# EAGLE board kulgurpowerMCU2 (EAGLE 6.3)
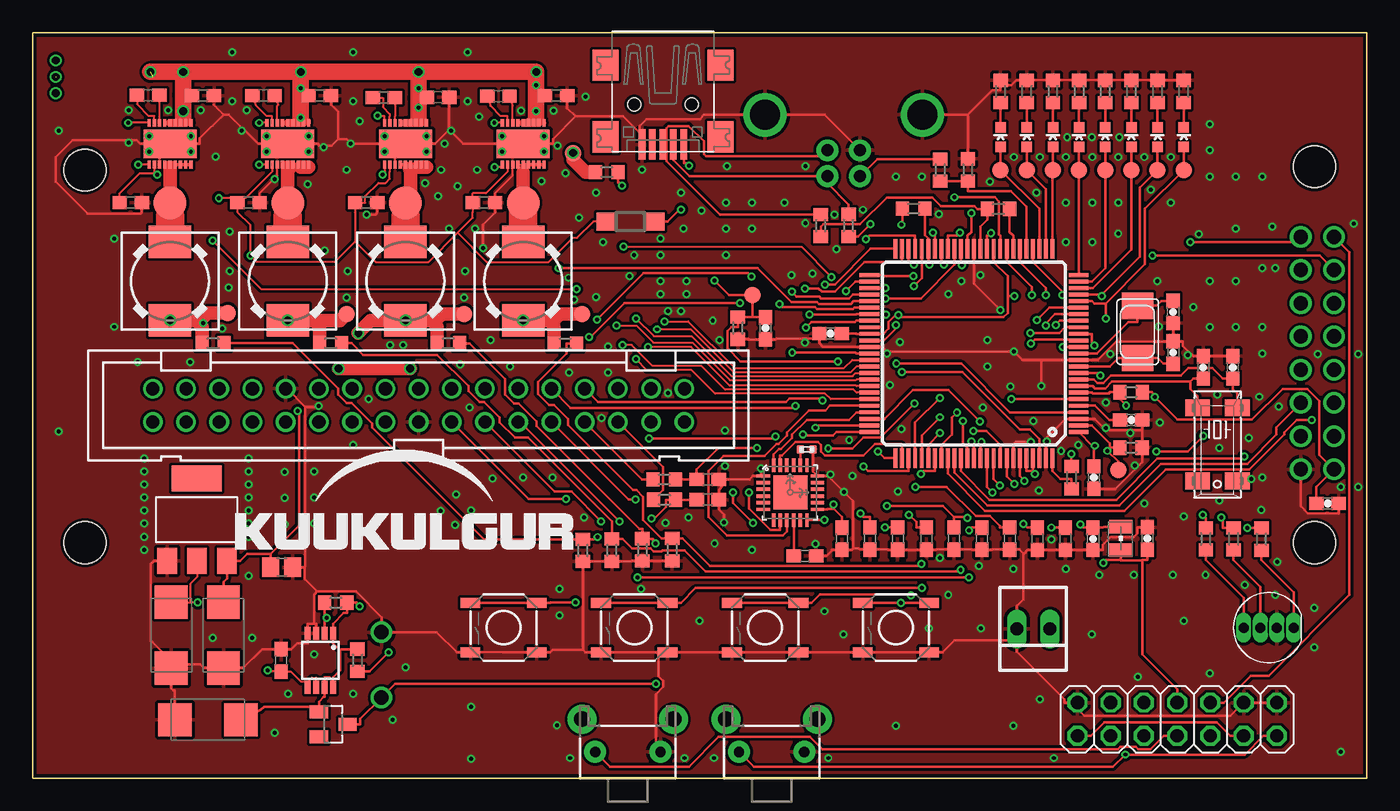
[diagram p6: board, top side]
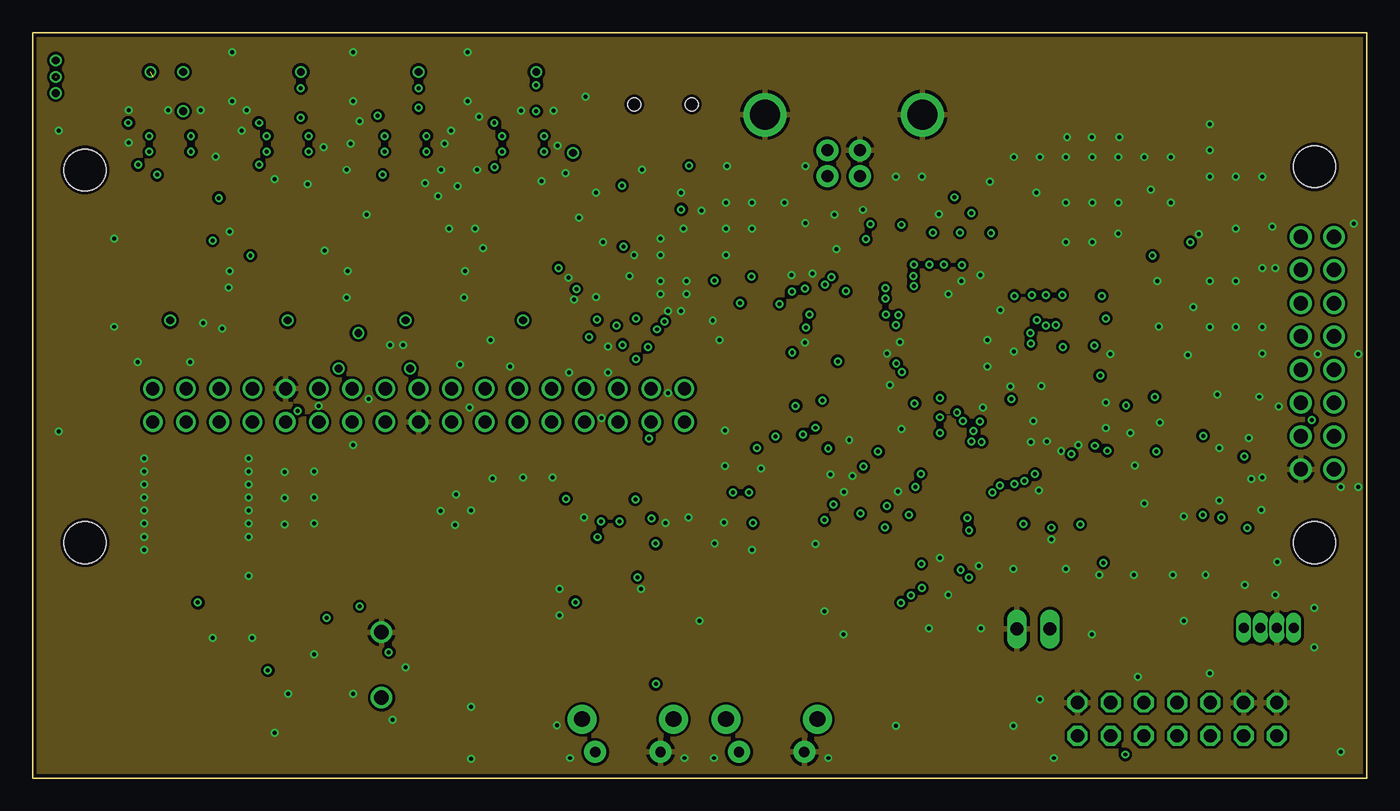
[diagram p7: board, inner layer Route2]
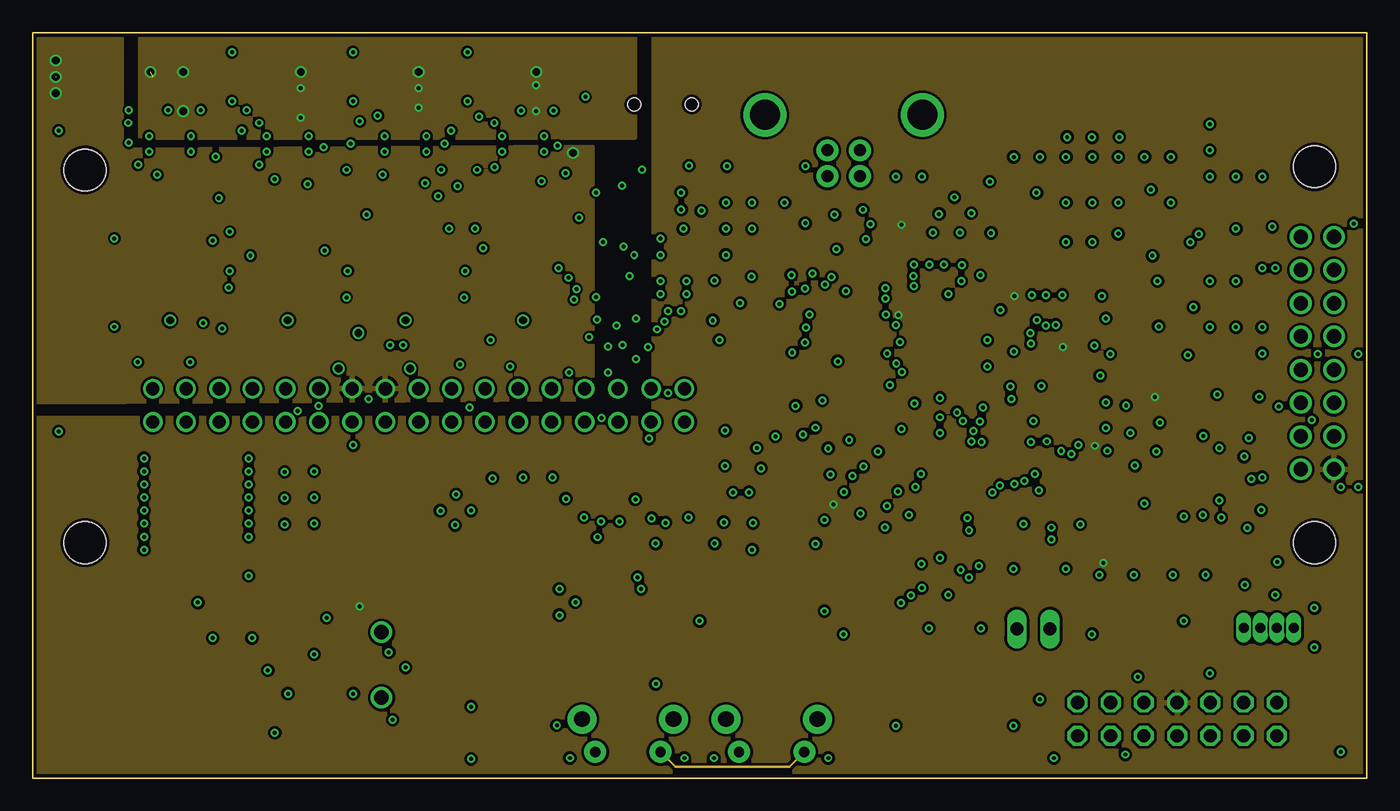
[diagram p8: board, inner layer Route15]
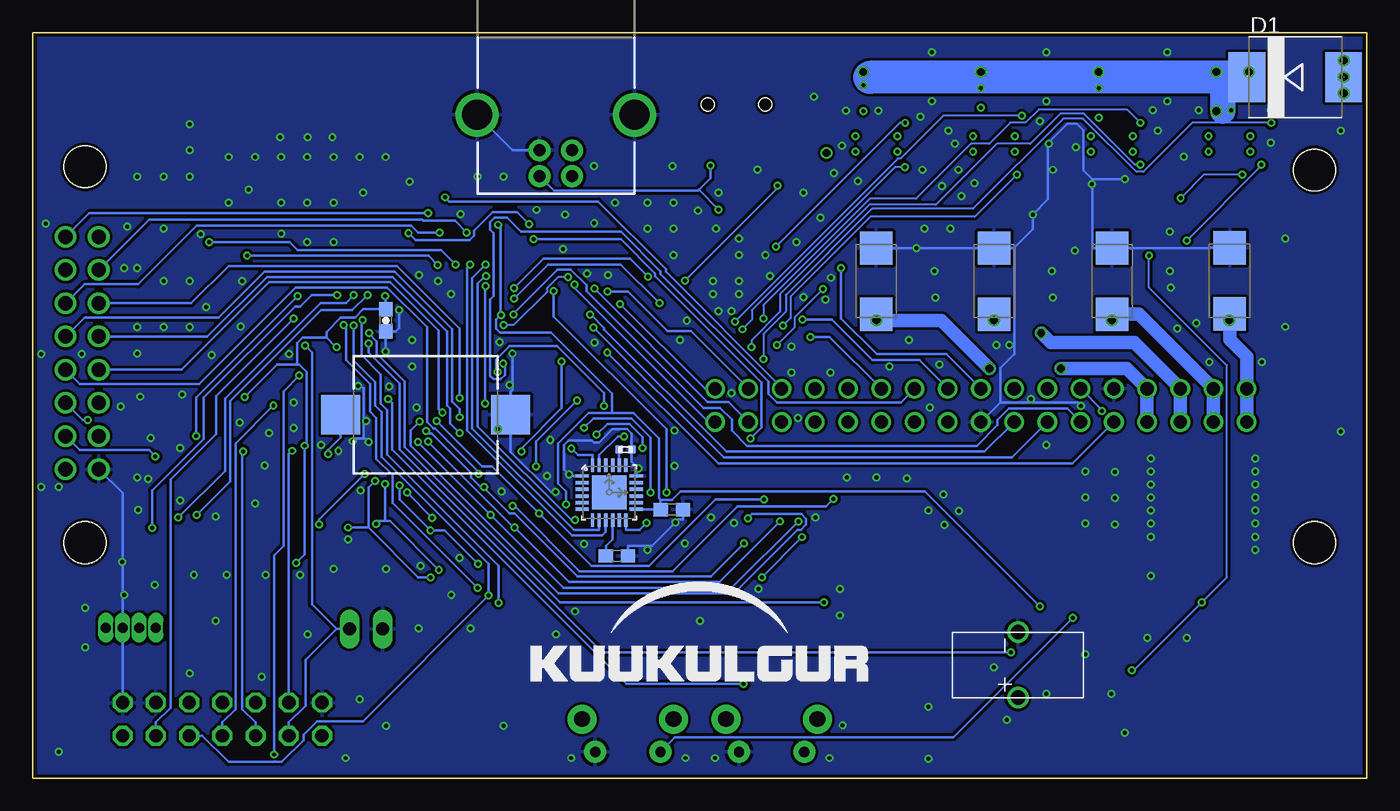
[diagram p9: board, bottom side, seen from below]

Size 102 x 57 mm. Coordinates in mm from the lower left corner, seen from the top.
Outline: 0,0 0,57 102,57 102,0 0,0
Copper layers (1*2*15*16): Top 0.035mm / dielectric 0.2mm / Route2 0.0175mm / dielectric 1.1mm / Route15 0.0175mm / dielectric 0.2mm / Bottom 0.035mm
Design rules "SeeedStudio_DRU_no_angle_20130527": minimum track width 6mil, minimum drill 12mil, track to track 6mil, track to pad 6mil, pad to pad 6mil, via to via 6mil, smd to smd 0mil, copper to edge 10mil, drill to drill 10mil, minimum pad ring 6mil, minimum via ring 6mil, stop-mask expansion 2mil, vias tented up to drill 25mil, thermal gap 10mil
Net classes: 0 default: width 0.203 mm, drill 0.3 mm, clearance 0.203 mm; 1 power: width 0.635 mm, drill 0.6 mm, clearance 0.178 mm; 2 morepower: width 1.016 mm, drill 0.6 mm, clearance 0.178 mm; 3 thin: width 0.152 mm, drill 0.3 mm, clearance 0.152 mm

## Footprints (pad centres in the part's own frame; a part is rotated, then mirrored left to right if it is on the bottom)
B1,27 = smd 1.27 x 1.27: TP 0,0
C0603 = smd 1.1 x 1: 1 -0.85,0; 2 0.85,0
0603-CAP = smd 1.1 x 1: 1 -0.85,0; 2 0.85,0
C/6032-28R = smd 2.55 x 2.5: + 2.525,0; - -2.525,0
C0402 = smd 0.59 x 0.64: 1 -0.48,0; 2 0.48,0
C0805 = smd 1.3 x 1.5: 1 -0.85,0; 2 0.85,0
USB-MINIB = smd 0.5 x 2.308: D+ 0,4.064; D- -0.8,4.064; GND 1.6,4.064; ID 0.8,4.064; VBUS -1.6,4.064 | smd 2 x 2.4: GND1 -4.4,-2; GND2 -4.4,3.5; GND3 4.4,3.5; GND4 4.4,-2 | hole 1: -2.2,1; 2.2,1
SMC = smd 2.8 x 3.8: A 3.7,0; C -3.7,0
SOD123 = smd 1.4 x 1.4: A 1.9,0; C -1.9,0
SOT23 = smd 1 x 1.4: 1 -0.95,-1.1; 2 0.95,-1.1; 3 0,1.1
LED-RGB-THRU = drill 0.762 pad 0.889 long: 1 1.905,0; 2 0.635,0; 3 -0.635,0; 4 -1.905,0
MSOP8 = smd 0.45 x 1: 1 -0.975,-2.05; 2 -0.325,-2.05; 3 0.325,-2.05; 4 0.975,-2.05; 5 0.975,2.05; 6 0.325,2.05; 7 -0.325,2.05; 8 -0.975,2.05
SOT223 = smd 1.499 x 2.007: 1 -2.261,-3.15; 2 0.025,-3.15; 3 2.311,-3.15 | smd 3.81 x 2.007: 4 0,3.15
2X07 = drill 1.016 octagon: 1 -7.62,-1.27; 2 -7.62,1.27; 3 -5.08,-1.27; 4 -5.08,1.27; 5 -2.54,-1.27; 6 -2.54,1.27; 7 0,-1.27; 8 0,1.27; 9 2.54,-1.27; 10 2.54,1.27; 11 5.08,-1.27; 12 5.08,1.27; 13 7.62,-1.27; 14 7.62,1.27
WE-KI_0805_B = smd 1.02 x 1.78: 1 -0.89,0; 2 0.89,0
DR73 = smd 2.5 x 3.25: 1 -3,0; 2 3,0
LED-0603 = smd 0.8 x 0.8: A 0,-0.75; C 0,0.75
MM20SS = smd 1.27 x 1.88: 1 -2.794,-1.524; 2 2.794,-1.524; 3 2.794,1.524; 4 -2.794,1.524
R0603 = smd 1 x 1.1: 1 -0.85,0; 2 0.85,0
TACTILE-PTH-SIDEEZ = drill 0.8 pad 1.7: 1 -2.5,0; 2 2.5,0 | drill 1.2 pad 2.2: ANCHOR1 -3.5,2.5; ANCHOR2 3.5,2.5
TACTILE_SWITCH_SMD = smd 1.524 x 0.762: 1 -2.54,1.905; 2 2.54,1.905; 3 -2.54,-1.905; 4 2.54,-1.905
BUZZER-CMT1102 = smd 3 x 3: 1 -6.5,0; 2 6.5,0
B2,54 = smd 2.54 x 2.54: TP 0,0
QFN-24-TESTING = smd 1.016 x 0.254: 1 -2.066,1.257; 2 -2.066,0.75; 3 -2.066,0.247; 4 -2.066,-0.287; 5 -2.066,-0.792; 6 -2.066,-1.297; 13 2.086,-1.297; 14 2.086,-0.792; 15 2.086,-0.287; 16 2.086,0.247; 17 2.086,0.75; 18 2.086,1.257 | smd 0.254 x 1.016: 7 -1.267,-2.122; 8 -0.762,-2.122; 9 -0.258,-2.122; 10 0.278,-2.122; 11 0.78,-2.122; 12 1.287,-2.122; 19 1.287,2.082; 20 0.78,2.082; 21 0.278,2.082; 22 -0.258,2.082; 23 -0.762,2.082; 24 -1.267,2.082 | smd 2.616 x 2.616: P$1 0.02,-0.01
EDLRD224V3R6C = drill 1.1: N 2.5,0; P -2.5,0
USB-B-PTH = drill 0.914 pad 1.676: D+ 0,1.25; D- 1.981,1.25; GND 0,-1.25; VBUS 1.981,-1.25 | drill 2.286: S1 -2.718,-6.02; S2 -2.718,6.02
ER-OLEDM032-1 = drill 1.1: P$1 96.2,8.11; P$2 98.74,8.11; P$3 96.2,10.65; P$4 98.74,10.65; P$5 96.2,13.19; P$6 98.74,13.19; P$7 96.2,15.73; P$8 98.74,15.73; P$9 96.2,18.27; P$10 98.74,18.27; P$11 96.2,20.81; P$12 98.74,20.81; P$13 96.2,23.35; P$14 98.74,23.35; P$15 96.2,25.89; P$16 98.74,25.89 | hole 3.2: 3.25,31; 3.25,2.5; 97.25,2.5; 97.25,31.25
LTQFP100 = smd 1.5 x 0.3: 1 -8,6; 2 -8,5.5; 3 -8,5; 4 -8,4.5; 5 -8,4; 6 -8,3.5; 7 -8,3; 8 -8,2.5; 9 -8,2; 10 -8,1.5; 11 -8,1; 12 -8,0.5; 13 -8,0; 14 -8,-0.5; 15 -8,-1; 16 -8,-1.5; 17 -8,-2; 18 -8,-2.5; 19 -8,-3; 20 -8,-3.5; 21 -8,-4; 22 -8,-4.5; 23 -8,-5; 24 -8,-5.5; 25 -8,-6; 51 8,-6; 52 8,-5.5; 53 8,-5; 54 8,-4.5; 55 8,-4; 56 8,-3.5; 57 8,-3; 58 8,-2.5; 59 8,-2; 60 8,-1.5; 61 8,-1; 62 8,-0.5; 63 8,0; 64 8,0.5; 65 8,1; 66 8,1.5; 67 8,2; 68 8,2.5; 69 8,3; 70 8,3.5; 71 8,4; 72 8,4.5; 73 8,5; 74 8,5.5; 75 8,6 | smd 0.3 x 1.5: 26 -6,-8; 27 -5.5,-8; 28 -5,-8; 29 -4.5,-8; 30 -4,-8; 31 -3.5,-8; 32 -3,-8; 33 -2.5,-8; 34 -2,-8; 35 -1.5,-8; 36 -1,-8; 37 -0.5,-8; 38 0,-8; 39 0.5,-8; 40 1,-8; 41 1.5,-8; 42 2,-8; 43 2.5,-8; 44 3,-8; 45 3.5,-8; 46 4,-8; 47 4.5,-8; 48 5,-8; 49 5.5,-8; 50 6,-8; 76 6,8; 77 5.5,8; 78 5,8; 79 4.5,8; 80 4,8; 81 3.5,8; 82 3,8; 83 2.5,8; 84 2,8; 85 1.5,8; 86 1,8; 87 0.5,8; 88 0,8; 89 -0.5,8; 90 -1,8; 91 -1.5,8; 92 -2,8; 93 -2.5,8; 94 -3,8; 95 -3.5,8; 96 -4,8; 97 -4.5,8; 98 -5,8; 99 -5.5,8; 100 -6,8
CSD97374Q4M = smd 0.25 x 0.6: P$1 -1.6,-1.6; P$2 -1.2,-1.6; P$3 -0.8,-1.6; P$4A -0.4,-1.6; P$4B 0,-1.6; P$4C 0.4,-1.6; P$4D 0.8,-1.6; P$4E 1.2,-1.6; P$4F 1.6,-1.6; P$5A -0.4,1.6; P$5B 0,1.6; P$5C 0.4,1.6; P$5D 0.8,1.6; P$5E 1.2,1.6; P$5F 1.6,1.6; P$6 -0.8,1.6; P$7 -1.2,1.6; P$8 -1.6,1.6 | smd 4.05 x 2.2: PAD@1 0,0 | drill 0.3: PAD@9 -1.6,0.6; PAD@10 -1.6,-0.6; PAD@11 1.6,0.6; PAD@12 1.6,-0.6
NX5032 = smd 2 x 2.4: P$1 2,0; P$2 -2,0
PAK100/2500-34 = drill 1 pad 1.422: 1 -20.32,-1.27; 2 -20.32,1.27; 3 -17.78,-1.27; 4 -17.78,1.27; 5 -15.24,-1.27; 6 -15.24,1.27; 7 -12.7,-1.27; 8 -12.7,1.27; 9 -10.16,-1.27; 10 -10.16,1.27; 11 -7.62,-1.27; 12 -7.62,1.27; 13 -5.08,-1.27; 14 -5.08,1.27; 15 -2.54,-1.27; 16 -2.54,1.27; 17 0,-1.27; 18 0,1.27; 19 2.54,-1.27; 20 2.54,1.27; 21 5.08,-1.27; 22 5.08,1.27; 23 7.62,-1.27; 24 7.62,1.27; 25 10.16,-1.27; 26 10.16,1.27; 27 12.7,-1.27; 28 12.7,1.27; 29 15.24,-1.27; 30 15.24,1.27; 31 17.78,-1.27; 32 17.78,1.27; 33 20.32,-1.27; 34 20.32,1.27
22-23-2021 = drill 1 long: 1 -1.27,0; 2 1.27,0

## Placement (x,y rotation side)
19V  TPB1,27  [B1,27]  41.32,47.8 90 top
AN0  TPB1,27  [B1,27]  55.05,36.92 90 top
C1  0.1  [C0603]  72.57,18.31 270 top
C2  0.1  [C0603]  74.69,18.32 270 top
C3  0.1  [C0603]  66.13,18.31 270 top
C4  0.1  [0603-CAP]  83.98,27.39 180 top
C5  0.1  [C0603]  64.01,18.32 270 top
C6  18pf  [0603-CAP]  87.19,32.54 270 top
C7  18pf  [0603-CAP]  87.19,35.64 90 top
C8  0.1  [C0603]  76.82,18.3 270 top
C9  [0603-CAP]  89.49,31.41 270 top
C10  0.1  [C0603]  68.32,18.31 270 top
C11  [0603-CAP]  91.76,31.41 270 top
C12  0.1  [0603-CAP]  56.03,34.4 270 top
C13  0,1  [0603-CAP]  81.07,18.3 270 top
C14  0,1  [0603-CAP]  85.23,18.33 90 top
C15  0.1  [C0603]  78.94,18.3 270 top
C16  [C/6032-28R]  10.59,10.93 90 top
C17  0.1  [C0603]  70.44,18.32 270 top
C18  [C/6032-28R]  13.39,4.45 0 top
C19  100n  [C0603]  59.05,16.97 0 top
C20  2.2nF / 50V  [C0402]  59.18,25.12 0 top
C21  100n  [C0603]  61.88,18.3 270 top
C22  0.1  [C0603]  51.61,22.83 0 top
C23  1uF/ 26V  [C0805]  19.03,16.13 0 top
C24  100n  [C0603]  57.33,16.98 0 bottom
C25  2.2nF / 50V  [C0402]  56.68,25.11 0 bottom
C26  100n  [C0603]  53.13,20.52 0 bottom
C27  0.1  [C0603]  8.83,52.21 0 top
C28  1uF/6V  [C0603]  19,9 90 top
C29  0.1  [C0603]  25.5,44 0 top
C30  0.1  [C0603]  31,52.05 0 top
C31  0.1  [C0603]  17.65,52.19 0 top
C32  0.1  [C0603]  7.5,44 0 top
C33  0.1  [C0603]  40.02,52.17 0 top
C34  0.1  [C0603]  26.85,52.02 0 top
C35  0.1  [C0603]  16.5,44 0 top
C36  0.1  [C0603]  21.95,52.18 0 top
C37  0.1  [C0603]  35.61,52.13 0 top
C38  0.1  [C0603]  34.5,44 0 top
C39  0.1  [C0603]  13.01,52.19 0 top
C40  0.1  [C0603]  51.61,21.29 0 top
C41  [C/6032-28R]  14.59,10.94 90 top
C42  [C/6032-28R]  10.49,38.02 270 bottom
C43  [C/6032-28R]  19.48,38 270 bottom
C44  [C/6032-28R]  28.5,38 270 bottom
C45  [C/6032-28R]  37.52,38 270 bottom
C46  0,1  [0603-CAP]  61,34 180 top
C47  0,1  [0603-CAP]  75,35 270 bottom
C48  0,1  [0603-CAP]  81.14,22.98 270 top
C49  0,1  [0603-CAP]  99,21 0 top
CN2  [USB-MINIB]  48.19,52.51 180 top
D1  MBRS320T3  [SMC]  5.47,53.59 0 bottom
D2  MBR0520LT  [SOD123]  45.69,42.56 0 top
D7  BAT54  [SOT23]  22.98,4.12 270 top
D8  WP154A4SUREQBFZGW  [LED-RGB-THRU]  94.5,11.5 0 top
EMLE  TPB1,27  [B1,27]  82.99,23.58 0 top
IC2  TPS77333DGK  [MSOP8]  22,9 180 top
IC3  REG1117-5  [SOT223]  12.54,19.75 0 top
JP2  [2X07]  87.5,4.5 0 top
L1  4,7uH  [WE-KI_0805_B]  83.19,18.32 90 top
L2  4,7uH  [DR73]  10.5,38 270 top
L3  4,7uH  [DR73]  19.5,38 270 top
L4  4,7uH  [DR73]  28.5,38 270 top
L5  4,7uH  [DR73]  37.5,38 270 top
LED0  [LED-0603]  74,49 0 top
LED1  [LED-0603]  76,49 0 top
LED2  [LED-0603]  78,49 0 top
LED3  [LED-0603]  80,49 0 top
LED4  [LED-0603]  82,49 0 top
LED5  [LED-0603]  84,49 0 top
LED6  [LED-0603]  86,49 0 top
LED7  [LED-0603]  88,49 0 top
Q1  [MM20SS]  90.57,25.51 270 top
R1  301k  [R0603]  40.72,33.22 0 top
R2  100k  [R0603]  48.89,17.47 270 top
R3  301k  [R0603]  31.78,33.23 0 top
R4  100k  [R0603]  46.62,17.45 270 top
R5  47k  [R0603]  83.98,29.51 0 top
R6  47k  [R0603]  24.84,9.01 90 top
R7  1k  [R0603]  74,52.5 270 top
R8  1k  [R0603]  76,52.5 270 top
R9  47k  [R0603]  67.36,43.54 0 top
R10  1k5  [R0603]  73.84,43.51 180 top
R11  301k  [R0603]  22.78,33.25 0 top
R12  1k  [R0603]  78,52.5 270 top
R13  100k  [R0603]  44.28,17.42 270 top
R14  1k  [R0603]  80,52.5 270 top
R15  47k  [R0603]  83.97,25.27 0 top
R16  301k  [R0603]  13.8,33.25 0 top
R17  100k  [R0603]  42.06,17.4 270 top
R18  100k  [R0603]  53.92,34.4 270 top
R19  1k  [R0603]  79.43,22.96 270 top
R22  47k  [R0603]  23.17,13.42 180 top
R23  680k  [R0603]  43.89,46.33 180 top
R24  22r  [R0603]  62.37,42.26 90 top
R25  22r  [R0603]  60.25,42.25 90 top
R26  30k  [R0603]  71.5,46.5 90 top
R27  17k  [R0603]  69.38,46.49 270 top
R28  1k  [R0603]  82,52.5 270 top
R29  1k  [R0603]  84,52.5 270 top
R30  1k  [R0603]  86,52.5 270 top
R31  1k  [R0603]  88,52.5 270 top
R32  1k  [R0603]  93.94,18.27 90 top
R33  1k  [R0603]  91.81,18.28 90 top
R34  1k  [R0603]  89.69,18.29 90 top
R35  10k  [R0603]  48.29,22.83 0 top
R36  10k  [R0603]  48.31,21.29 0 top
S1  PROG  [TACTILE-PTH-SIDEEZ]  45.5,2 0 top
S2  SW4  [TACTILE_SWITCH_SMD]  66,11.5 180 top
S6  SW1  [TACTILE_SWITCH_SMD]  36,11.5 180 top
S7  SW2  [TACTILE_SWITCH_SMD]  46,11.5 180 top
S8  SW3  [TACTILE_SWITCH_SMD]  56,11.5 180 top
S9  RESET  [TACTILE-PTH-SIDEEZ]  56.5,2 0 top
SG1  BUZZERSMD3  [BUZZER-CMT1102]  71.97,27.79 0 bottom
TP5  TPB2,54  [B2,54]  19.5,44 180 top
TP8  TPB2,54  [B2,54]  10.5,44 180 top
TP10  TPB2,54  [B2,54]  28.5,44 180 top
TP15  TPB2,54  [B2,54]  37.5,44 180 top
TPLED0  LED0  [B1,27]  74,46.5 90 top
TPLED1  LED0  [B1,27]  76,46.5 90 top
TPLED2  LED0  [B1,27]  78,46.5 90 top
TPLED3  LED0  [B1,27]  80,46.5 90 top
TPLED4  LED0  [B1,27]  82,46.5 90 top
TPLED5  LED0  [B1,27]  84,46.5 90 top
TPLED6  LED0  [B1,27]  86,46.5 90 top
TPLED7  LED0  [B1,27]  88,46.5 90 top
U1  MPU-6000QFN-24  [QFN-24-TESTING]  57.91,21.84 0 top
U2  MPU-6000QFN-24  [QFN-24-TESTING]  57.93,21.84 0 bottom
U$1  EDLRD224V3R6C  [EDLRD224V3R6C]  26.66,8.65 90 bottom
U$2  USB+SHIELD  [USB-B-PTH]  62,48 270 bottom
U$3  ER-OLEDM032-1  [ER-OLEDM032-1]  0.75,15.5 0 top
U$14  R5F5630ADDFP  [LTQFP100]  71.97,32.47 180 top
U$16  CSD97374Q4M  [CSD97374Q4M]  10.5,48.5 0 top
U$17  CSD97374Q4M  [CSD97374Q4M]  19.5,48.5 0 top
U$18  CSD97374Q4M  [CSD97374Q4M]  28.5,48.5 0 top
U$19  CSD97374Q4M  [CSD97374Q4M]  37.5,48.5 0 top
VBAT0  TPB1,27  [B1,27]  14.92,35.57 180 top
VBAT1  TPB1,27  [B1,27]  24,35.5 0 top
VBAT2  TPB1,27  [B1,27]  33,35.5 180 top
VBAT3  TPB1,27  [B1,27]  42,35.5 180 top
X1  12Mhz  [NX5032]  84.47,34.12 270 top
X2  2534-  [PAK100/2500-34]  29.5,28.5 0 top
X3  22-23-2021  [22-23-2021]  76.5,11.4 180 top

## Tracks (layer width: path | path; a pad name or v marks a point on that pad's centre or on a via)
5V  (via drill 0.3 pad 0.61)
  Top 0.152: U$19.P$2 36.3,46.37 34.66,44.73 33.65,44.73 C38.1 33.65,43.27 33.65,42.85 32.49,41.69 | D2.C 42.86,42.56 41.62,41.32 41.3,41.32 39.45,39.47 34.71,39.47 32.49,41.69 | 9.3,46.23 8.16,46.23 6.65,44.73 C32.1 | v9.52,46.13 9.41,46.23 9.3,46.23 | U$16.P$2 9.3,46.23 | 15.65,44.36 v14.24,44.36 | 15.65,44.36 16.29,44.36 18.3,46.37 U$17.P$2 | 24.65,41.04 26.23,39.46 30.26,39.46 32.49,41.69 | 24.65,41.04 23.08,39.47 17.13,39.47 v16.65,39.95 16.65,42.28 15.65,43.27 C35.1 15.65,44.36 | 24.65,41.04 24.65,43.27 C29.1 25.43,44 25.43,44.49 26.44,45.51 26.98,45.51 27.3,45.83 27.3,46.37 U$18.P$2 | v17.98,8.23 18.19,8.23 18.27,8.15 C28.1 19.73,8.15 20.52,7.36 21.02,7.36 | v12.63,13.42 12.11,13.42 12.07,13.45 | IC3.2 12.56,15.37 12.07,14.88 12.07,13.45 | C16.+ 12.07,13.45 | 21.02,7.36 21.34,7.68 21.68,7.68 IC2.6 | 21.02,7.36 21.02,7.31 IC2.5
  Bottom 0.152: v9.52,46.13 12.48,46.13 v14.24,44.36 | v16.65,39.95 16.65,37.52 10.69,31.56 10.69,15.36 v12.63,13.42 17.82,8.23 v17.98,8.23
!OLED_CS  (via drill 0.3 pad 0.61)
  Top 0.203: JP2.10 91.06,5.77 93.12,7.83 94.51,7.83 100.67,13.99 100.67,40.21 U$3.P$16 | U$14.39 71.47,41.47 71.76,41.76 v71.76,43.2
  Bottom 0.203: v71.76,43.2 97.69,43.2 U$3.P$16
!OLED_DC  (via drill 0.3 pad 0.61)
  Top 0.203: v71.05,39.24 71.05,39.39 70.97,39.47 U$14.40 | v71.05,39.24 | U$3.P$14 98.4,39.94 v85.62,39.94
  Bottom 0.203: v85.62,39.94 71.75,39.94 v71.05,39.24
!OLED_RD  (via drill 0.3 pad 0.61)
  Top 0.203: U$14.42 69.97,41.47 70.65,41.47 v70.89,41.71
  Bottom 0.203: v70.89,41.71 72.52,41.71 73.05,42.25 89.46,42.25 93.93,37.77 98.03,37.77 U$3.P$12
!OLED_RESET  (via drill 0.3 pad 0.61)
  Top 0.203: U$14.43 69.47,39.47 | v88.51,40.98 96.54,40.98 U$3.P$15 | 69.47,39.47 | 69.47,39.47 v69.68,39.25
  Bottom 0.203: v88.51,40.98 82.35,40.98 81.73,40.36 70.79,40.36 v69.68,39.25
!OLED_WR  (via drill 0.3 pad 0.61)
  Top 0.203: U$14.44 68.97,41.56 v68.82,41.71
  Bottom 0.203: U$3.P$13 93.1,42.7 72.24,42.7 72.15,42.61 69.72,42.61 v68.82,41.71
!RESET  (via drill 0.3 pad 0.61)
  Top 0.203: S9.1 55.14,0.86 82.59,0.86 v83.53,1.8 92.67,1.8 94.1,3.23 JP2.13 | U$14.10 81.41,30.97 v81.61,30.77 | 22.32,12.25 22.32,12.61 22.32,12.62 R22.2 | IC2.2 22.32,12.25 | v22.48,12.25 22.32,12.25
  Bottom 0.203: v81.61,30.77 82.83,29.56 82.83,17.74 83.53,17.04 v83.53,1.8 | v22.48,12.25 31.6,3.12 52.88,3.12 S9.1
!SKIP0  (via drill 0.3 pad 0.61)
  Top 0.152: v45.1,33.13 45.8,33.13 47.4,31.53 51.12,31.53 52.94,29.71 62.75,29.71 62.99,29.47 U$14.69 | U$16.P$1 v8.05,46.9 | v13.77,41.1 17.48,37.39 v41.57,37.39
  Bottom 0.152: v41.57,37.39 43.76,35.2 43.76,34.47 v45.1,33.13 | v13.77,41.1 8.05,46.82 v8.05,46.9
!SKIP1  (via drill 0.3 pad 0.61)
  Top 0.152: v47.04,32.97 50.33,32.97 53.29,30.01 62.95,30.01 62.99,29.97 U$14.68 | U$17.P$1 v17.31,46.9
  Bottom 0.152: v17.31,46.9 17.72,46.9 21.63,50.81 23.42,50.81 25.73,48.5 28.29,48.5 32.95,43.84 38.03,43.84 44.85,37.02 44.85,35.66 47.04,33.47 v47.04,32.97
!SKIP2  (via drill 0.3 pad 0.61)
  Top 0.152: v44.64,34.6 46.16,34.6 47.46,33.3 50.43,33.3 53.31,30.42 62.94,30.42 62.99,30.47 U$14.67 | v26.76,46.13 26.76,46.23 26.9,46.37 U$18.P$1
  Bottom 0.152: v26.76,46.13 29.98,42.92 37.97,42.92 44.06,36.83 44.06,35.17 v44.64,34.6
!SKIP3  (via drill 0.3 pad 0.61)
  Top 0.152: v47.75,34.32 50.28,34.32 53.56,31.03 62.55,31.03 62.99,31.47 U$14.65 | v35.32,46.71 35.9,46.71 U$19.P$1
  Bottom 0.152: v35.32,46.71 36.07,46.71 47.02,35.77 47.02,35.05 v47.75,34.32
!SW1  (via drill 0.3 pad 0.61)
  Top 0.203: v41.49,13.45 39.6,13.45 39.56,13.4 S6.3 38.36,13.4 38.17,13.4 38.03,13.4 37.52,13.4 S6.4 | U$14.17 78.93,34.47 78.48,34.03 v76.29,34.03 | v76.29,34.03
  Bottom 0.203: v41.49,13.45 61.69,13.45 73.55,25.3 73.55,30.34 75.69,32.48 75.69,33.38 76.29,33.98 v76.29,34.03
!SW2  (via drill 0.3 pad 0.61)
  Top 0.203: v67.98,14.53 50.68,14.53 49.56,13.4 S7.3 48.03,13.4 47.52,13.4 44.48,13.4 S7.4 | U$14.18 78.52,34.97 v78.21,34.66
  Bottom 0.203: v67.98,14.53 74.5,21.05 74.5,23.16 75.73,24.4 75.73,27.53 76.22,28.02 76.22,30.12 78.04,31.95 78.04,34.49 v78.21,34.66
!SW3!/TMS  (via drill 0.3 pad 0.61)
  Top 0.203: v67.13,13.97 67.06,14.05 60.2,14.05 59.56,13.4 S8.3 57.52,13.4 53.97,13.4 S8.4 | U$14.19 78.16,35.47 77.45,34.76 v77.45,34.62 | v77.45,34.62
  Bottom 0.203: v77.45,34.62 77.45,31.93 75.81,30.29 75.81,28.48 75.33,28 75.33,24.57 67.13,16.37 v67.13,13.97 76.75,4.36 80.24,4.36 81.3,3.29 81.3,2.9 82.97,1.23 87.02,1.23 89.02,3.23 JP2.9
!SW4
  Top 0.203: 79.97,35.97 78.97,35.97
!SW4!/TDI  (via drill 0.3 pad 0.61)
  Top 0.203: v76.76,35.01 77.72,35.97 78.97,35.97 U$14.20 | S2.4 64.48,13.4 v66.39,13.4 67.52,13.4 S2.3
  Bottom 0.203: v66.39,13.4 | v66.39,13.4 66.39,16.21 74.92,24.74 74.92,28.16 75.41,28.65 75.41,30.87 76.87,32.33 76.87,34.9 v76.76,35.01
!TRST  (via drill 0.3 pad 0.61)
  Top 0.203: v81.18,33.07 80.97,33.27 80.97,33.97 U$14.16
  Bottom 0.203: 78.78,11.4 80.65,13.27 80.65,32.54 v81.18,33.07 | 78.78,11.4 78.73,11.4 X3.1 | JP2.3 82.42,4.25 81.15,5.52 81.15,9.03 78.78,11.4
+3V3  (via drill 0.3 pad 0.61)
  Top 0.203: 74.55,36.87 v75.06,36.87 | 74.55,36.87 74.55,38.38 73.47,39.47 U$14.35 | 74.55,36.87 74.55,35.57 74.23,35.24 66.36,35.24 v66.2,35.41 65.97,35.41 65.44,34.87 65.44,34.36 65.06,33.97 64.97,33.97 U$14.60 63.86,33.97 62.97,33.97 62.94,34 C46.1 | v24.99,13.12 24.78,13.34 24.78,13.42 R22.1 24.02,12.62 23.79,12.62 22.98,11.8 IC2.1 22.98,10.3 23.5,9.77 | v61.22,20.94 61.22,20.56 | 61.22,20.56 61.27,20.56 61.88,19.96 C21.1 | 61.22,20.56 60.78,20.56 60.76,20.55 U1.13 | v78.76,32.97 78.97,32.97 U$14.14 | C49.1 98.15,22.27 U$3.P$2 98.38,24.72 98.38,28.82 97.43,29.77 95.56,29.77 93.21,27.42 87.52,27.42 v85.78,29.16 85.78,29.3 85.58,29.51 R5.2 | v66.42,42.3 66.51,42.39 R9.1 | 81.14,25.41 v81.22,25.41 | 83.19,16.67 82.05,16.67 v81.85,16.47 | U$14.1 81.03,25.41 81.14,25.41 | 81.14,25.41 81.14,24.63 C48.1 | 84.83,16.66 84.83,9.46 87.5,6.79 JP2.8 | 84.83,16.66 83.2,16.66 83.19,16.67 | 22.98,7.33 22.98,7.42 22.69,7.7 22.32,7.7 IC2.7 22.32,6.2 22.26,6.2 21.88,5.82 21.88,5.45 | 22.98,7.33 22.98,7.7 23.5,8.23 23.5,9.77 | IC2.8 22.98,7.33 | 23.5,9.77 23.59,9.86 24.13,9.86 R6.2 | C18.+ 17.45,5.2 17.69,5.45 21.88,5.45 | D7.1 21.88,5.45 | 84.83,16.66 84.84,16.68 85.23,16.68 C14.1 | L1.1 83.19,16.67
  Bottom 0.203: v75.06,36.87 75,36.81 75,36.65 C47.1 75.75,35.85 76.72,35.85 77.36,35.22 78.44,35.22 79.54,34.12 79.54,33.68 | 53.98,21.28 53.12,21.28 52.49,21.91 33.78,21.91 v24.99,13.12 | 53.98,21.28 C26.1 54.79,20.52 54.81,20.55 U2.13 | 57.72,27.91 56.05,27.91 54.12,25.98 54.12,21.42 53.98,21.28 | 57.72,27.91 57.72,27.9 59.52,27.9 61.84,25.59 61.84,22.52 61.22,21.9 v61.22,20.94 | v66.21,35.41 66.56,35.05 66.56,34.38 66.25,34.07 62.39,34.07 57.72,29.4 57.72,27.91 | 79.54,33.68 78.83,32.97 v78.76,32.97 | 79.54,33.68 81.35,33.68 81.76,33.27 81.76,31.62 | v66.2,35.41 v66.21,35.41 | v66.21,35.41 66.21,42.09 v66.42,42.3 | 81.76,31.62 81.64,31.62 81.05,31.03 81.05,25.58 v81.22,25.41 81.22,17.1 v81.85,16.47 | 81.76,31.62 83.32,31.62 v85.78,29.16
  pour Route15: 0,27.5 47.5,27.5 47.5,57 102,57 102,0 0,0
+19V  (via drill 0.6, 0.6 pad 0.9)  (1 unrouted)
  Top 1.016: 19V.TP 41.32,47.29 42.27,46.33 R23.2
  other vias: 41.32,47.8 1.77,53.62 1.77,54.87 1.77,52.37
  pour Route15: 0,57 6.75,57 6.75,48 42.75,48.25 42.75,29 0,28.75
AN0  (via drill 0.3 pad 0.61)
  Top 0.203: v61.55,31.87 54.13,31.87 53.11,32.89 53.11,34.17 53.44,34.5 53.91,34.5 R18.1 55.05,35.25 | U$14.76 65.13,24.47 v64.63,24.96 | v52.12,38.05 53.25,36.92 AN0.TP 55.05,35.25 | v45.06,45.32 44.85,45.53 44.74,45.53 R23.1 | 55.05,35.25 55.26,35.25 55.27,35.25 C12.1
  Bottom 0.203: v64.63,24.96 64.63,25.2 61.55,28.28 v61.55,31.87 | v45.06,45.32 45.06,45.11 v52.12,38.05
AN1  (via drill 0.3 pad 0.61)
  Top 0.203: v58.87,26.26 58.95,26.19 61.18,26.19 61.47,26.47 U$14.75 | v55.36,25.25 52.42,25.25 50.76,23.59 C22.1 49.89,22.84 R35.2
  Bottom 0.203: v58.87,26.26 58.05,27.09 56.38,27.09 55.36,26.07 v55.36,25.25
AN3  (via drill 0.3 pad 0.61)
  Top 0.203: U$14.73 65.11,27.47 67.32,29.68 70.02,29.68 v72.44,27.27 | v47.33,19.87 47.53,19.87 48.41,20.75 48.41,21.29 R36.2 49.91,21.29 C40.1
  Bottom 0.203: v47.33,19.87 47,20.2 43.24,20.2 42.87,19.83 42.87,19.39 43.28,18.98 43.52,18.98 48.4,14.11 61.78,14.11 73.12,25.45 73.12,26.59 v72.44,27.27
AVCC0  (via drill 0.3 pad 0.61)
  Top 0.203: 76.47,23.57 76.64,23.39 v76.64,23.24 | v80.09,19.4 80.31,19.17 80.31,19.15 C13.1 81.82,19.15 81.89,19.21 82.05,19.21 L1.2 | 76.47,23.57 76.47,23.47 75.97,23.47 U$14.96 | U$14.97 76.47,23.57
  Bottom 0.203: v80.09,19.4 80.09,19.79 v76.64,23.24
BAT0_EN  (via drill 0.3 pad 0.61)
  Top 0.203: v58.07,32.54 62.89,32.54 62.97,32.47 U$14.63
  Bottom 0.203: X2.9 22.52,24.05 49.58,24.05 v58.07,32.54
BAT1_EN  (via drill 0.3 pad 0.61)
  Top 0.203: v65.23,35.45 64.97,35.19 64.97,34.47 U$14.59
  Bottom 0.203: X2.11 22.89,28.24 27.37,28.24 28.23,27.38 28.23,26.99 29.83,25.4 47.38,25.4 48.55,26.57 48.55,27.41 49.44,28.3 50.72,28.3 59.67,37.24 59.67,37.68 60.86,38.87 61.89,38.87 65.23,35.54 v65.23,35.45
BAT2_EN  (via drill 0.3 pad 0.61)
  Top 0.203: v59.12,34.45 59.54,34.88 62.87,34.88 62.97,34.97 U$14.58
  Bottom 0.203: X2.13 27.15,24.5 49.16,24.5 v59.12,34.45
BAT3_EN  (via drill 0.3 pad 0.61)
  Top 0.203: v59.38,35.45 62.94,35.45 62.97,35.47 U$14.57
  Bottom 0.203: v59.38,35.45 59.32,35.45 58.31,34.43 58.31,34.29 48.97,24.95 29.23,24.95 X2.15
BUZZER
  Top 0.203: R19.2 79.43,22.87 78.57,22.87 77.97,23.47 U$14.100
BUZZER_X  (via drill 0.3 pad 0.61)
  Top 0.203: v79.43,24.77 R19.1
  Bottom 0.203: SG1.1 78.47,26.04 79.43,25.07 v79.43,24.77
COMPUTER_PWR  (via drill 0.3 pad 0.61)
  Top 0.203: X2.28 43.23,28.74 57.59,28.74 57.87,29.02 60.21,29.02 v60.36,28.87 | v63.51,23.81 63.86,23.47 66.97,23.47 U$14.78
  Bottom 0.203: v63.51,23.81 63.51,25.72 v60.36,28.87
CPOUT1
  Top 0.203: U1.20 C20.1
CPOUT2
  Bottom 0.203: U2.20 C25.1
D0  (via drill 0.3 pad 0.61)
  Top 0.203: v92.62,24.58 92.46,24.43 85.98,24.43 82.84,21.28 73.15,21.28 70.97,23.47 U$14.86
  Bottom 0.203: U$3.P$4 98.41,25.07 93.11,25.07 v92.62,24.58
D1
  Top 0.203: U$3.P$5 95.08,26.82 95.08,26.25 92.85,24.02 86.27,24.02 83.09,20.84 72.98,20.84 70.47,23.35 70.47,23.47 U$14.85
D2  (via drill 0.3 pad 0.61)
  Top 0.203: v97.8,27.37 96.65,27.37 95.69,26.42 95.69,26.29 93.02,23.61 86.64,23.61 83.47,20.43 72.81,20.43 69.97,23.28 69.97,23.47 U$14.84
  Bottom 0.203: U$3.P$6 98.17,27.37 v97.8,27.37
D3  (via drill 0.3 pad 0.61)
  Top 0.203: U$14.83 69.47,25.47 70.27,26.27 70.27,27.55 v70.68,27.97
  Bottom 0.203: U$3.P$7 90.61,31.23 83.92,37.92 74.66,37.92 70.95,34.21 70.95,28.24 v70.68,27.97
D4  (via drill 0.3 pad 0.61)
  Top 0.203: v67.9,23.25 68.12,23.47 68.97,23.47 U$14.82
  Bottom 0.203: v67.9,23.25 67.9,23.39 71.25,26.74 71.35,26.74 71.86,27.25 71.86,34.47 74.9,37.51 81.89,37.51 89.26,30.14 98.4,30.14 U$3.P$8
D5  (via drill 0.3 pad 0.61)
  Top 0.203: v69.37,26.37 68.47,25.47 U$14.81
  Bottom 0.203: U$3.P$9 88.65,33.77 84.09,38.33 74.49,38.33 70.32,34.16 70.32,28.48 70.1,28.26 70.1,27.1 v69.37,26.37
D6  (via drill 0.3 pad 0.61)
  Top 0.203: U$14.80 67.97,26.19 v69.37,27.59
  Bottom 0.203: U$3.P$10 98.03,35.23 87.76,35.23 84.26,38.73 74.32,38.73 69.92,34.33 69.92,28.78 69.37,28.23 v69.37,27.59
D7  (via drill 0.3 pad 0.61)
  Top 0.203: U$14.79 67.47,27.19 v69.36,29.08
  Bottom 0.203: U$3.P$11 89.86,36.31 87.03,39.14 74.14,39.14 69.36,34.36 v69.36,29.08
D+
  Top 0.203: R25.2 59.45,43.1 52.55,43.1 48.47,47.18 48.47,48.45 | 48.47,48.45 CN2.D+ | 48.47,48.45 48.47,49.71 48.62,49.86 50.15,49.86 51.32,48.69 51.32,47.71 51.47,47.56 60.31,47.56 U$2.D+
D-
  Top 0.203: CN2.D- 48.99,47.24 50.21,46.02 U$2.D- 60.75,45.48 62.38,43.86 R24.2
EMLE  (via drill 0.3 pad 0.61)
  Top 0.203: 82.37,25.27 82.37,25.57 80.97,26.97 U$14.2 | EMLE.TP 82.99,24.2 v82.16,25.03 82.37,25.23 82.37,25.27 | R15.1 82.37,25.27
  Bottom 0.203: JP2.4 82.42,24.77 v82.16,25.03
ENABLE_PWR  (via drill 0.3 pad 0.61)
  Top 0.203: v70.47,44.41 73.55,44.41 73.88,44.09 73.88,41.57 73.97,41.47 U$14.34
  Bottom 0.203: v70.47,44.41 70.16,44.1 | 70.16,44.1 | 70.16,44.1 58.77,44.1 53.59,38.92 53.59,38.73 44.74,29.88 X2.30
EXTAL
  Top 0.203: U$14.13 80.97,32.47 81.37,32.47 83.76,34.86 84.47,34.86 X1.P$2 85.11,36.12 85.93,36.12 86.3,36.49 86.44,36.49 C7.2
GND  (via drill 0.3 pad 0.61)
  Top 0.14: U$16.PAD@1 10.5,48.22 9.7,47.42 U$16.P$3 | U$17.P$3 18.7,46.07 18.46,45.83 17.35,44.72 C35.2 | U$19.P$3 36.7,46.07 35.35,44.72 35.35,44.06 | U$18.P$3 27.7,47.7 U$18.PAD@1
  Top 0.152: 36,9.6 S6.2 | 85.4,53.35 R29.1 R28.1 R14.1 R12.1 R8.1
  Top 0.203: v60.98,23.21 60.83,23.07 | 60.83,23.07 60.8,23.1 U2.1 59.66,23.44 C20.2 | 60.83,23.07 v62.04,21.86 62.72,21.18 62.72,17.6 62.75,17.57 | S1.2 47.64,2.36 47.64,6.4 48.2,6.96 48.2,7.42 47.85,7.78 47.85,9.41 | 47.85,9.41 | 77.11,31.97 78.97,31.97 79.47,31.97 U$14.12 81.45,31.97 82.87,33.39 C6.1 | 77.11,31.97 75.65,31.97 v75,32.62 65.49,32.62 v65.33,32.46 65.33,32.61 64.97,32.97 U$14.62 62.97,32.97 60.43,32.97 60.15,33.25 60.15,33.63 | 77.11,31.97 v77.11,29.98 | C6.1 87.94,33.39 87.94,33.04 88.73,32.26 C9.1 91,32.26 C11.1 | C7.1 87.19,33.99 C6.1 | U$14.94 74.97,25.47 75.19,25.69 v76.33,25.69 | U$14.99 77.47,25.7 v77.53,25.76 77.53,26.04 78.97,27.47 U$14.3 80.08,27.47 80.97,27.47 81.23,27.47 82.06,26.64 84.82,26.64 | v73.99,35.8 71.97,37.83 71.97,39.47 U$14.38 | v52.84,19.56 52.84,20.16 52.46,20.53 C40.2 52.46,21.5 52.46,22.04 52.71,22.29 52.71,22.84 | 79.37,5.77 80.39,4.75 91.56,4.75 JP2.12 94.1,5.77 JP2.14 | 79.37,5.77 78.86,5.77 78.86,6.01 75.23,9.64 75.23,10.52 | JP2.2 79.37,5.77 | 47.85,9.41 47.67,9.6 44.48,9.6 S7.2 42.26,9.6 42.06,9.8 | 75.73,17.19 75.8,17.19 76.06,17.45 C8.2 78.19,17.45 C15.2 79.69,17.45 80.31,17.45 | 75.73,17.19 75.45,17.47 C2.2 73.33,17.47 73.32,17.46 C1.2 71.81,17.46 71.8,17.47 71.19,17.47 C17.2 69.08,17.47 69.07,17.46 C10.2 66.89,17.46 | 75.73,17.19 75.73,13.65 75.23,13.15 X3.2 75.23,11.07 75.23,10.52 | U$2.GND 60.53,50.72 U$2.S2 51.33,50.72 51.01,50.39 46.95,50.39 46.4,49.84 46.4,49.34 | 23.34,48.84 23.99,48.84 v24.32,48.51 26.21,48.51 26.22,48.5 U$18.PAD@1 30.78,48.5 31.85,49.57 | 80.31,17.45 | 80.31,17.45 C13.2 81.82,17.45 81.82,17.82 82.42,18.43 84.19,18.43 84.47,18.71 84.47,19.18 C14.2
  Top 0.203: 75.23,10.52 70.48,10.52 69.56,9.6 S2.1 S2.2 59.56,9.6 S8.1 S8.2 52.44,9.6 49.56,9.6 48.95,9.6 S7.1 48.03,9.6 47.85,9.41 | 42.06,9.8 42.06,15.8 R17.2 43.45,16.55 43.47,16.57 R13.2 45.08,16.57 45.78,16.57 45.82,16.61 R4.2 47.42,16.61 47.44,16.62 48.09,16.62 48.49,16.62 R2.2 | 84.82,26.64 84.83,26.64 C4.1 | 84.82,26.64 84.82,26.07 R15.2 84.82,24.16 82.79,22.12 81.89,22.12 C48.2 | 60.15,33.63 56.86,33.63 56.78,33.55 C12.2 55.27,33.55 54.73,33.55 54.72,33.55 R18.2 | 55.56,23.1 55.69,23.22 v55.69,23.69 | 55.56,23.1 55.08,23.1 54.82,22.84 53.27,22.84 52.71,22.84 | U1.1 55.56,23.1 | 42.06,9.8 39.76,9.8 39.56,9.6 S6.1 36,9.6 | 20.83,28.39 20.83,16.18 20.78,16.13 | X2.10 19.45,29.77 20.83,28.39 | 20.83,28.39 21.79,28.39 v21.86,28.45 | 14.59,50.74 12.78,48.92 12.78,48.5 U$16.PAD@1 8.22,48.5 7.94,48.78 3.08,48.78 1.78,47.48 1.78,45.59 4.21,43.17 8.27,43.17 8.35,43.25 C32.2 | 14.59,50.74 14.98,50.74 17.22,48.5 U$17.PAD@1 20.64,48.5 21.78,48.5 21.92,48.36 22.87,48.36 23.34,48.84 | 14.59,50.74 | 14.59,50.74 13.85,51.48 | v18.5,45.79 18.46,45.83 | v34.43,40.52 34.43,42.33 35.35,43.25 C38.2 35.35,44.06 | v25.53,43.1 26.2,43.1 26.35,43.25 C29.2 | 23.34,48.84 23.34,50.94 22.8,51.49 C36.2 | C23.2 20.78,16.13 | 21.51,11.8 21.68,11.8 IC2.3 | 21.51,11.8 21.02,11.8 IC2.4 21.02,10.3 20.2,10.3 19.75,9.85 19.22,9.85 C28.2 17.53,9.85 16.09,8.41 C41.- 13.08,8.41 12.8,8.69 10.88,8.69 | 21.75,14.26 21.51,14.02 21.51,11.8 | 21.75,14.26 24.71,14.26 26.66,12.3 U$1.N 30.89,11.15 32.44,9.6 S6.2 | 21.75,14.26 20.78,15.22 20.78,16.13 | 10.88,8.69 C16.- 10.59,6.87 10.76,6.71 10.87,6.71 C18.-
  Top 0.203: 10.88,8.69 9.04,10.53 9.04,16.37 9.28,16.61 IC3.1 | CN2.GND 46.4,48.64 46.4,49.06 46.4,49.34 | 41.5,50.6 39.78,48.88 39.78,48.5 U$19.PAD@1 32.92,48.5 31.85,49.57 | 46.4,49.34 45.14,50.6 41.5,50.6 | 41.5,50.6 40.87,51.22 40.87,51.42 C33.2 | C30.2 31.85,49.57 | C46.2 60.15,33.63 | 62.75,17.57 62.63,17.45 C21.2 61.12,17.45 61.12,17.39 60.7,16.97 C19.2 | 62.75,17.57 63.15,17.57 63.25,17.47 C5.2 65.37,17.47 65.38,17.46 C3.2 66.89,17.46 | C22.2 52.71,22.84 | R31.1 R30.1 85.4,53.35 | U$3.P$1 96.95,20.79 97.49,20.25 99.85,20.25 C49.2 | R8.1 75.2,53.35 74.82,52.97 74,52.97 | 74,52.97 74,52.6 73.38,52.6 71.5,50.72 | R7.1 74,52.97 | 66.89,17.46 | 71.5,50.72 R26.2 | 71.5,50.72 | 71.5,50.72 U$2.S1
  Route15 0.203: S1.2 49.13,0.86 57.87,0.86 S9.2
  Bottom 0.203: 76.7,25.98 77.3,25.98 v77.53,25.76 | v76.33,25.69 76.62,25.98 76.7,25.98 | v77.11,29.98 76.7,29.82 76.7,25.98 | v73.99,35.8 73.99,34.4 74.25,34.15 C47.2 75,33.35 75,33.34 v75,32.62 | U2.1 60.76,23.1 60.87,23.21 v60.98,23.21 61.38,23.61 61.38,25.46 61.03,25.81 59.24,25.81 59.08,25.64 58.69,25.64 57.65,26.68 56.55,26.68 56.2,26.34 C25.2 56.2,24.21 v55.69,23.69 55.85,23.53 U2.18 | U$2.GND 65.3,48 U$2.S1 | C24.2 56.48,17.74 54.66,17.74 v52.84,19.56 52.63,19.77 52.28,19.77 C26.2 | v62.04,21.86 62.38,21.86 65.47,24.95 65.47,26.04 SG1.2 65.47,29.55 65.33,29.68 v65.33,32.46 | JP2.14 95.12,6.79 95.14,6.8 D8.2 95.14,21.8 U$3.P$1 | 24.37,48.57 v24.32,48.51 | 24.37,48.57 24.37,44.25 v25.53,43.1 25.53,41.99 27,40.52 | 24.37,48.57 | 20.99,45.79 21.69,46.49 21.69,49.56 22.17,50.04 22.89,50.04 24.37,48.57 | 28.02,28.7 22.1,28.7 v21.86,28.45 | 28.02,28.7 28.02,31.37 26.94,32.44 26.94,40.47 27,40.52 | X2.17 28.03,28.7 28.02,28.7 | 20.99,45.79 v18.5,45.79 | 20.99,45.79 20.99,40.52 C43.- 17.98,40.52 12.02,40.52 11.99,40.55 C42.- | 27,40.52 C44.- 30,40.52 v34.43,40.52 36.01,40.52 C45.-
  other vias: 70,37 71,38 81,41 79,41 90,38 92,38 94,39 95,39 86,38 90,34.48 92,34.48 94,34.48 94,32.48 73,33.48 73,31.48 58,38.48 54.99,42 52.99,42 49.74,42 52.99,40 47.99,40 45.99,40 47.99,38 49.99,38 49.99,37 47.99,37 51.99,35 43.99,33 43.99,31 40.99,31 34.99,33.51 23.99,36.76 32.99,36.76 41.38,36.57 14.48,34.37 6.24,41.26 14.99,37.51 6.24,34.51 1.99,26.51 1.99,49.51 13.99,47.51 15.99,49.51 23.99,46.51 31.99,49.51 33.99,46.51 30.99,44.51 25.01,50.23 52.99,44 54.99,44 65.99,46 67.99,46 89.99,46 91.99,46 93.99,46 89.99,48 89.99,50 91.99,42 92.99,26 93.99,23 87.99,20 84.99,21 80.99,11 78.99,16 74.99,16 69.99,14 61.99,11 84.28,23.89 86.16,27.18 93.77,29.16 93.19,22.85 94.99,14 97.99,13 89.99,8 87.99,12 97.99,10 99.99,2 74.99,4 65.99,4 76.99,6 50.99,12 55,17.46 62.66,23.09 66.15,21.93 52.15,17.93 50.15,19.93 42.15,19.93 35.15,22.93 37.49,23 48.38,19.53 32.36,21.69 33.51,20.46 31.18,20.44 32.29,19.34 33.39,28.35 43.48,27.54 65.54,30.04 72.65,28.33 66.42,26.69 90.56,29.33 90.73,25.24 90.73,21.24 82.99,41.62 79,44 81,44 83,44 87,44 76.75,44.75 73.17,45.61 69.3,43.13 63.46,43.45 59.06,42.42 59.09,46.78 53.08,46.78 49.58,44.78 43.08,44.78 33.08,38.78 24.08,38.78 15.08,38.78 15.08,41.78 21.02,45.42 32.47,45.27 38.9,45.63 34.14,50.59 43.6,40.98 41.76,42.85 33.51,5.46 33.51,1.46 18.51,3.46 8.51,17.46 8.51,18.46 8.51,19.46 8.51,20.46 8.51,21.46 8.51,22.46 8.51,23.46 16.51,23.46 16.51,22.46 16.51,21.46 16.51,20.46 16.51,19.46 16.51,18.46 21.51,19.46 21.51,21.46 21.51,23.46 16.51,15.46 19.51,6.46 24.51,6.46 28.51,8.46 27.51,4.46 21.51,9.46 72.51,11.46 46.51,14.46 76.94,21.99 77.88,18.26 93.92,20.49 80.99,49 61.46,40.45 72.46,38.45 66.3,33.34 59.63,38.58 76.51,27.29 52.92,23.87 24.51,25.46 8.51,24.46 16.51,24.46 36.51,31.46 27.32,33.1 28.32,33.1 32.67,31.63 12.04,31.81 8.04,31.81 13.04,34.81 25.69,28.98 42.25,52.09 40.12,48.38 51.12,43.38 74.74,29.93 79.94,25.46 72.34,16.21 69.37,16.85 59.86,17.91 48.56,29.46 59.03,33.29 61.31,43.07 88.33,32.34 86.09,34.54 22.33,40.34 43.08,36.78 40.97,38.25 15.24,51.76 15.24,55.51 24.49,51.76 24.49,55.51 33.24,51.76 33.24,55.51 37.33,51.02 39.83,51.02 10.35,51.08 12.85,51.08 7.35,51.08 16.35,51.08 95.27,28.41 98.27,32.41 94.77,42.16 19.27,23.41 19.27,21.41 19.27,19.41 60.54,12.76 84.49,7.75 78.07,1.53 60.82,1.53 52.07,1.53 49.82,1.53 41.07,1.53 40.07,4.03 13.76,10.71 16.76,10.71 79.09,49.03 83.09,49.03 81,47.5 83,47.5 79,47.5 85,47.5 87,47.5 77,47.5 75,47.5 85.5,45 88.75,36 68.51,11.46 40.26,12.46 40.26,14.46 62.43,25.85 52.94,26.56 83.91,26.39 82.05,26.79 82.06,28.73 82.4,32.42 89.15,41.6 101.02,42.41 99.99,22.25 101.34,22.26 101.33,32.42 39.74,23 45.64,38.4 57.49,44 46.58,46.53 47.99,41.25 52.49,33.5 48.57,35.7 49.57,35.7 31.83,42.03 33.83,42.03 81.57,15.53 84.17,15.53 87.17,15.53 89.67,15.53 92.67,14.78 95.17,16.53 22.24,48.26 31.49,48.51 31.24,46.51 29.99,45.51 40.74,46.26 78.63,25 7.35,48.58
  pour Top: 0,57 0,0 102,0 102,57
  pour Bottom: 0,57 0,0 102,0 102,57
  pour Route2: 0,0 101.75,0 101.75,57 0,57
IBAT0_AD  (via drill 0.3 pad 0.61)
  Top 0.203: v65.3,20.79 69.61,20.79 70.44,19.96 | X2.19 37.92,21.35 v40.77,21.35 | 70.44,19.96 71.38,19.96 v71.45,19.9 | U$14.90 72.97,22.26 v73.39,21.84 | C17.1 70.44,19.96
  Bottom 0.203: v40.77,21.35 41.36,20.76 48.13,20.76 53.08,15.81 60.18,15.81 65.16,20.79 v65.3,20.79 | v73.39,21.84 v71.45,19.9
IBAT1_AD  (via drill 0.3 pad 0.61)
  Top 0.203: v43.47,19.62 41.18,21.91 39.9,21.91 X2.21 | U$14.89 72.47,25.63 v72.55,25.71 | C10.1 67.56,19.16 67.56,19.57 v67.01,20.13
  Bottom 0.203: v43.47,19.62 48.56,14.53 61.41,14.53 v67.01,20.13 72.55,25.67 v72.55,25.71
IBAT2_AD  (via drill 0.3 pad 0.61)
  Top 0.203: v44.86,19.63 37.26,27.23 X2.23 | v65.17,19.16 65.38,19.16 C3.1 | U$14.88 71.97,25.52 v71.77,25.72
  Bottom 0.203: v44.86,19.63 49.48,15 61.01,15 v65.17,19.16 65.25,19.16 71.77,25.69 v71.77,25.72 | v71.77,25.72
IBAT3_AD  (via drill 0.3 pad 0.61)
  Top 0.203: U$14.87 71.47,25.23 71.14,25.56 v71.14,27.31 | v71.14,27.31 | X2.25 45.57,21.32 v46.08,21.32 | v63.28,20.22 63.53,19.97 64.01,19.97 C5.1
  Bottom 0.203: v71.14,27.31 67.64,23.82 66.88,23.82 v63.28,20.22 59.29,16.23 54.88,16.23 49.78,21.32 v46.08,21.32
IMON1
  Top 0.203: X2.27 46.59,22.84 R35.1
IMON2
  Top 0.203: X2.29 48.19,23.78 48.19,22.01 R36.1
INT_GYRO1  (via drill 0.3 pad 0.61)
  Top 0.203: v67.33,38.38 65.06,38.38 64.97,38.47 U$14.51 | U1.12 v60.54,19.72
  Bottom 0.203: v67.33,38.38 67.43,38.38 67.99,37.82 67.99,26.9 60.81,19.72 v60.54,19.72
INT_GYRO2  (via drill 0.3 pad 0.61)
  Top 0.203: U$14.52 62.9,37.97 v62.16,37.23 | v55.07,19.5 53.55,21.02 v53.55,21.84
  Bottom 0.203: v62.16,37.23 62.16,35.3 53.55,26.69 v53.55,21.84 | U2.12 56.65,18.96 55.6,18.96 v55.07,19.5
LED0
  Top 0.203: LED0.A TPLED0.TP 76.97,43.53 76.97,41.47 U$14.28
LED1
  Top 0.203: LED1.A TPLED1.TP 77.47,45.03 77.47,41.47 U$14.27
LED2
  Top 0.203: LED2.A TPLED2.TP 77.97,46.47 77.97,41.47 U$14.26
LED3
  Top 0.203: LED3.A TPLED3.TP 80,38.5 U$14.25
LED4
  Top 0.203: U$14.24 80.97,37.97 82,39 TPLED4.TP LED4.A
LED5
  Top 0.203: U$14.23 81.05,37.47 84,40.42 TPLED5.TP LED5.A
LED6/TDO  (via drill 0.3 pad 0.61)
  Top 0.203: 81.73,36.97 v81.73,36.88 | 81.73,36.97 80.97,36.97 U$14.22 | 81.73,36.97 84.64,39.88 84.64,45.14 TPLED6.TP LED6.A | v89.49,26.17 88.31,24.98 v85.91,24.98
  Bottom 0.203: v89.49,26.17 89.49,29.11 v81.73,36.88 | v85.91,24.98 85.98,24.92 85.98,5.26 84.96,4.25 JP2.5
LED7/TCK  (via drill 0.3 pad 0.61)
  Top 0.203: 82.05,36.29 85.05,39.29 85.05,43.55 TPLED7.TP LED7.A | 82.05,36.29 81.15,36.29 80.97,36.47 U$14.21 | 82.05,36.29 v82.05,35.15 | JP2.1 80.9,3.23 81.93,4.26 90.53,4.26 91.56,3.23 JP2.11
  Bottom 0.203: v82.05,35.15 87.97,29.23 87.97,26.32 91.45,22.83 91.45,5.37 92.58,4.25 JP2.11
LED_BLUE  (via drill 0.3 pad 0.61)
  Top 0.203: v76.39,36.95 76.39,37.54 74.47,39.47 U$14.33 | v89.46,20.11 89.68,19.89 89.69,19.89 R34.2
  Bottom 0.203: v89.46,20.11 86.89,22.68 86.89,28.85 79.96,35.77 77.57,35.77 v76.39,36.95
LED_GREEN  (via drill 0.3 pad 0.61)
  Top 0.203: v90.86,19.92 91.01,19.77 91.01,19.13 R33.2 | v77.46,36.93 77.46,37.48 75.47,39.47 U$14.31
  Bottom 0.203: v77.46,36.93 78.05,36.34 79.97,36.34 87.3,29.01 87.3,23.48 v90.86,19.92
LED_RED  (via drill 0.3 pad 0.61)
  Top 0.203: v78.72,36.95 78.72,37.21 76.47,39.47 U$14.29 | R32.2 93.13,19.12 v92.88,19.12
  Bottom 0.203: v78.72,36.95 80.67,36.95 81.55,36.07 81.94,36.07 88.93,29.08 88.93,25.93 92.88,21.98 v92.88,19.12
MD  (via drill 0.3 pad 0.61)
  Top 0.203: JP2.7 86.48,3.23 85.46,2.2 84.55,2.2 84.35,2.4 83.16,2.4 82.96,2.2 60.38,2.2 59.44,3.15 52.44,3.15 50.16,0.86 44.13,0.86 S1.1 | 82.75,29.51 82.75,29.33 v83.6,28.48 | 82.75,29.51 82.37,29.51 82.26,29.4 81.04,29.4 80.97,29.47 U$14.7 | R5.1 82.75,29.51
  Bottom 0.203: v83.6,28.48 86.48,25.6 86.48,5.26 87.5,4.25 JP2.7
MISOA  (via drill 0.3 pad 0.61)
  Top 0.203: v68.56,39.26 68.47,39.34 U$14.45 68.47,41.27 68.21,41.53 68.21,42.74 R9.2
  Bottom 0.203: v68.56,39.26 68.8,39.02 68.8,26.56 60.77,18.53 58.49,18.53 58.19,18.83 U2.9
MISOB
  Top 0.203: U1.9 57.65,18.84 57.35,18.54 53.07,18.54 51.66,19.95 51.66,23.47 52.81,24.62 55.93,24.62 56.87,25.56 57.03,25.56 57.65,26.19 57.65,26.43 59.34,28.11 60.6,28.11 60.96,28.47 62.97,28.47 U$14.71
MOSIA  (via drill 0.3 pad 0.61)
  Top 0.203: v67.43,28.65 64.82,26.05 63.52,26.05 62.69,25.21 v60.82,25.21 | v67.36,37.62 67.97,38.22 67.97,39.47 U$14.46
  Bottom 0.203: v60.82,25.21 60.3,24.69 59.2,24.69 U2.24 | v67.43,28.65 67.43,37.55 v67.36,37.62
MOSIB
  Top 0.203: U1.24 56.64,24.76 57.04,25.15 57.19,25.15 58.06,26.02 58.06,26.26 59.2,27.39 62.39,27.39 62.97,27.97 U$14.72
N$2
  Top 0.203: R7.2 LED0.C
N$3
  Top 0.203: C4.2 82.33,27.39 82.31,27.39 81.22,28.47 U$14.5
N$4
  Top 0.203: R32.1 93.94,16.67 96.41,14.2 D8.1
N$8
  Top 0.203: R8.2 LED1.C
N$9
  Top 0.203: R12.2 LED2.C
N$10
  Top 0.203: R14.2 LED3.C
N$11
  Top 0.203: R28.2 LED4.C
N$12
  Top 0.203: R29.2 LED5.C
N$13
  Top 0.203: R30.2 LED6.C
N$14
  Top 0.203: R31.2 LED7.C
N$15
  Top 0.203: R33.1 91.81,16.68 93.86,14.62 D8.3
N$17
  Top 0.203: R34.1 89.69,16.68 92.59,13.78 92.59,12.9 D8.4
N$18
  Top 0.152: U$19.P$7 36.3,50.63 35.78,50.63 35.01,51.4 C37.1
N$19
  Top 0.152: U$17.P$7 18.3,50.63 17.89,50.63 17.05,51.46 C31.1
N$20
  Top 0.14: C37.2 36.71,51.41 36.7,51.4 U$19.P$6
N$21
  Top 0.14: C31.2 18.75,51.47 18.7,51.42 U$17.P$6
N$22
  Top 0.152: U$16.P$7 9.3,50.63 8.89,50.63 7.98,51.54 C27.1
N$23
  Top 0.14: C27.2 9.68,51.54 9.7,51.52 U$16.P$6
N$24
  Top 0.152: C34.1 26.78,52.02 26.78,51.31 27.3,50.79 27.3,50.63 U$18.P$7
N$25
  Top 0.14: U$18.P$6 27.7,50.62 | C34.2 27.7,50.62 | 27.7,50.62
NMI  (via drill 0.3 pad 0.61)
  Top 0.203: v27.22,9.63 25.75,8.16 R6.1 | U$14.15 79.91,33.53 76.63,33.53 v76.31,33.21
  Bottom 0.203: v76.31,33.21 76.31,32.52 73.96,30.17 73.96,25.14 58.45,9.63 v27.22,9.63
OUT1_EN  (via drill 0.3 pad 0.61)
  Top 0.203: v40.2,39.01 55.42,39.01 58.02,36.41 59.97,36.41 60.12,36.26 62.56,36.26 62.77,36.47 62.97,36.47 U$14.55
  Bottom 0.203: X2.18 32.16,32.43 | 32.16,32.43 | 32.16,32.43 37.47,32.43 40.2,35.16 v40.2,39.01
OUT2_EN  (via drill 0.3 pad 0.61)
  Top 0.203: v43.14,35.05 46.7,38.61 54.7,38.61 v54.96,38.35 | v65.19,37.47 U$14.53
  Bottom 0.203: X2.20 34.22,31.95 37.79,31.95 40.89,35.05 v43.14,35.05 | v54.96,38.35 56.33,39.71 62.94,39.71 v65.19,37.47
OUT3_EN  (via drill 0.3 pad 0.61)
  Top 0.203: v66.02,31.69 71,31.69 74.72,27.97 78.97,27.97 U$14.4
  Bottom 0.203: v66.02,31.69 65.9,31.58 65.9,30.82 66.23,30.5 66.77,30.5 67.02,30.75 67.02,36.58 66.75,36.85 66.75,41.67 67.03,41.95 67.03,42.51 66.68,42.86 65.73,42.86 64.64,41.78 57.03,41.78 53.99,38.75 53.99,38.56 45.74,30.31 45.74,29.35 45.11,28.72 35.63,28.72 X2.22
OUT4_EN  (via drill 0.3 pad 0.61)
  Top 0.203: v65.18,36.68 67.9,36.68 70.47,39.25 70.47,39.47 U$14.41 | v54.09,36.33 45.26,36.33 42.66,33.72 v42.55,33.72
  Bottom 0.203: X2.24 41.07,33.72 v42.55,33.72 | v54.09,36.33 57.04,39.28 62.58,39.28 v65.18,36.68
OUT5_EN  (via drill 0.3 pad 0.61)
  Top 0.203: v58.33,28.46 58.18,28.31 41.12,28.31 X2.26 | v66.46,31.06 71.06,31.06 75.47,26.65 76.25,26.65 76.97,25.93 76.97,25.47 U$14.98
  Bottom 0.203: v66.46,31.06 66.59,31.18 66.59,32 65.56,33.03 61.92,33.03 58.33,29.44 v58.33,28.46
PGOOD1  (via drill 0.3 pad 0.61)
  Top 0.203: v59.05,37.44 60.09,37.44 60.33,37.19 61.34,37.19 63.61,39.47 66.47,39.47 U$14.49
  Bottom 0.203: v59.05,37.44 59.05,37.41 50.4,28.77 48.82,28.77 X2.31
PGOOD2  (via drill 0.3 pad 0.61)
  Top 0.203: v60.57,37.75 61.32,37.75 64.04,40.47 | 64.04,40.47 | 64.04,40.47 U$14.50
  Bottom 0.203: X2.33 50.32,27.23 60.57,37.48 v60.57,37.75
PWM0  (via drill 0.3 pad 0.61)
  Top 0.152: U$14.70 61.02,28.97 60.58,29.4 52.17,29.4 50.35,31.22 46.95,31.22 v46.12,32.05 | U$16.P$8 v7.31,50.1
  Bottom 0.152: v7.31,50.1 | v7.31,50.1 13.35,50.1 17.08,46.36 17.61,46.36 21.69,50.44 23.21,50.44 30.11,43.54 37.82,43.54 44.42,36.94 44.42,35.66 46.12,33.96 v46.12,32.05
PWM1  (via drill 0.3 pad 0.61)
  Top 0.152: v46.13,35.13 47.48,33.78 50.38,33.78 53.44,30.73 62.68,30.73 62.92,30.97 U$14.66 | U$17.P$8 v17.3,50.1
  Bottom 0.152: v17.3,50.1 18.32,51.12 25.09,51.12 26.09,50.12 27.25,50.12 28.87,48.5 30.26,48.5 34.45,44.31 37.99,44.31 46.13,36.17 v46.13,35.13
PWM2  (via drill 0.3 pad 0.61)
  Top 0.152: v26.38,50.65 26.41,50.63 26.9,50.63 U$18.P$8 | v48.3,34.92 50.11,34.92 53.69,31.34 62.02,31.34 62.66,31.97 U$14.64
  Bottom 0.152: v26.38,50.65 32.39,50.65 35.67,47.37 35.85,47.37 v48.3,34.92
PWM3  (via drill 0.3 pad 0.61)
  Top 0.152: v45.15,40.63 58.76,40.63 v61.09,38.31 | U$14.61 65.1,33.47 66,34.38 v66,34.64 | U$19.P$8 v35.29,50.1
  Bottom 0.152: v61.09,38.31 61.84,38.31 62.69,37.46 62.69,37.18 65.23,34.64 v66,34.64 | v35.29,50.1 35.69,50.1 v45.15,40.63
PWM4  (via drill 0.3 pad 0.61)
  Top 0.203: v57.09,36.24 57.32,36.01 59.8,36.01 59.95,35.85 62.73,35.85 62.84,35.97 62.97,35.97 U$14.56
  Bottom 0.203: v57.09,36.24 50.62,29.77 X2.34
PWM5  (via drill 0.3 pad 0.61)
  Top 0.203: v58.04,37.19 58.41,36.82 60.13,36.82 60.29,36.67 62.39,36.67 62.69,36.97 62.97,36.97 U$14.54
  Bottom 0.203: v58.04,37.19 56.48,37.19 53.46,34.17 51.68,34.17 X2.32
REGOUT1
  Top 0.203: U1.10 58.19,18.96 58.19,17.73 58.2,17.73 C19.1
REGOUT2
  Bottom 0.203: C24.1 58.18,17.74 57.66,18.26 57.66,18.96 U2.10
RSPCKA  (via drill 0.3 pad 0.61)
  Top 0.203: v47.13,25.95 56.63,25.95 v56.79,26.12 | v63.71,41.21 63.98,41.47 67.47,41.47 U$14.47
  Bottom 0.203: v56.79,26.12 57.26,26.12 58.69,24.69 U2.23 | v63.71,41.21 57.03,41.21 54.4,38.58 54.4,38.38 46.27,30.25 46.27,26.81 v47.13,25.95
RSPCKB
  Top 0.203: U$14.77 66.47,25.47 66.41,25.54 64.41,25.54 63.53,24.66 60.59,24.66 60.26,24.98 60.26,25.46 60.02,25.7 58.32,25.7 57.3,24.69 57.15,24.69 U1.23
SSLA0  (via drill 0.3 pad 0.61)
  Top 0.203: v67.36,39.25 67.14,39.47 66.97,39.47 U$14.48
  Bottom 0.203: v67.36,39.25 68.39,38.22 68.39,26.73 60.62,18.96 58.69,18.96 U2.8
SSLB0  (via drill 0.3 pad 0.61)
  Top 0.203: v59.84,26.79 60.02,26.97 62.97,26.97 U$14.74 | 54.76,20.6 56.4,18.96 57.15,18.96 U1.8 | 54.76,20.6 | 54.76,20.6 v54.76,21.86
  Bottom 0.203: v54.76,21.86 54.76,26.04 56.21,27.5 59.13,27.5 v59.84,26.79
SUPERCAP  (via drill 0.3 pad 0.61)
  Top 0.203: U$14.6 v74.82,28.97 | v47.64,7.19 27.71,7.19 U$1.P 25.04,4.52 25.04,4.12 D7.3
  Bottom 0.203: v47.64,7.19 56.59,7.19 74.52,25.12 74.52,28.67 v74.82,28.97
USB0_DM  (via drill 0.3 pad 0.61)
  Top 0.203: U$14.36 72.97,41.47 73.07,41.47 v73.28,41.68 | v64.05,42.35 63.11,41.41 R24.1
  Bottom 0.203: v64.05,42.35 64.97,43.27 66.85,43.27 68.26,41.86 68.26,41.48 68.61,41.13 72.72,41.13 v73.28,41.68
USB0_DP
  Top 0.203: U$14.37 72.47,41.47 72.47,42.19 72.99,42.71 R10.2 72.24,43.52 72,43.75 69.43,43.75 68.79,44.39 65.31,44.39 63.26,42.34 60.44,42.34 60.25,42.15 R25.1
USB0_DPUPE
  Top 0.203: U$14.32 74.97,41.47 74.69,41.75 74.69,42.71 R10.1
USB0_VBUS
  Top 0.203: U$14.30 75.97,41.47 75.97,43.7 74.78,44.9 71.5,44.9 R26.1 70.19,45.65 70.18,45.64 R27.2
V+  (via drill 0.3 pad 0.61)
  Top 0.203: 18.18,17.13 20.36,19.31 20.36,28 v20.27,28.09 | 18.18,17.13 16.38,17.13 15.85,16.61 IC3.3 14.85,15.26 14.59,14.99 C41.+ | C23.1 18.18,17.13
  Bottom 0.203: X2.12 20.27,28.16 v20.27,28.09
VBAT0  (via drill 0.6 pad 0.9)
  Top 1.016: 12.81,35 12.81,34.62 12.95,34.48 R16.1 | L2.2 12.81,35 | VBAT0.TP 13.38,35.57 12.81,35
  Bottom 1.016: 10.49,34.52 10.5,34.53 L2.2 | 10.49,34.52 10.49,33.54 9.18,32.23 X2.2 X2.1 | C42.+ 10.49,34.52
  other vias: 10.5,35
VBAT0_AD  (via drill 0.3 pad 0.61)
  Top 0.203: C15.1 78.19,19.15 v77.88,19.15 | U$14.95 75.47,23.47 75.47,23.09 v75.83,22.72 | v71.58,15.35 v46.23,15.35 | v43.17,18.42 43.03,18.42 42.86,18.25 R17.1 41.76,18.25 41.25,18.25 34.52,18.25 25.96,26.81 25.96,27.13 24.39,28.69 24.01,28.69 23.36,29.33 23.36,29.77 19.89,33.25 15.4,33.25 R16.2
  Bottom 0.203: 76.32,19.15 76.32,22.24 v75.83,22.72 | v71.58,15.35 72.52,15.35 76.32,19.15 | 76.32,19.15 v77.88,19.15 | v43.17,18.42 v46.23,15.35
VBAT1  (via drill 0.6 pad 0.9)
  Top 1.016: VBAT1.TP 23.5,35 21.81,35 | R11.1 21.93,34.48 21.81,34.6 21.81,35 | L3.2 21.81,35
  Bottom 1.016: L3.2 19.48,35.02 C43.+ 17.55,35.47 17.42,35.47 X2.4 X2.3
  other vias: 19.5,35
VBAT1_AD  (via drill 0.3 pad 0.61)
  Top 0.203: v75.06,22.47 74.47,23.06 74.47,23.47 U$14.93 | v70.95,15.92 70.83,15.8 51.44,15.8 49.84,17.4 48.14,17.4 48.06,17.32 47.45,17.32 47.22,17.55 45.8,17.55 45.08,18.27 R13.1 44.28,18.65 44.28,19.03 44.28,19.63 37.87,26.04 36.86,26.04 35.71,27.2 35.71,27.55 34.52,28.75 34.16,28.75 33.31,29.6 33.31,29.98 30.93,32.36 25.27,32.36 24.38,33.25 R11.2 | C8.1 76.06,19.15 v75.77,19.45 v75.76,19.45
  Bottom 0.203: 75.06,19.64 75.56,19.64 v75.76,19.45 | v70.95,15.92 74.67,19.64 75.06,19.64 | 75.06,19.64 v75.06,22.47
VBAT2  (via drill 0.6 pad 0.9)
  Top 1.016: v24.89,34.04 25.85,35 L4.2 30.81,35 | R3.1 30.93,34.47 30.81,34.59 30.81,35 | VBAT2.TP 31.31,35.5 30.81,35
  Bottom 1.016: X2.5 X2.6 17.78,33.29 24.14,33.29 v24.89,34.04 | L4.2 C44.+
  other vias: 28.5,35
VBAT2_AD  (via drill 0.3 pad 0.61)
  Top 0.203: v71.94,26.54 72.91,26.54 73.97,25.47 U$14.92 | v47.63,17.93 47.42,18.14 47.42,18.3 R4.1 46.62,19.06 46.4,19.06 38.53,26.93 38.53,27.26 37.15,28.64 36.81,28.64 36.12,29.34 36.12,30.5 33.39,33.23 R3.2 | v67.48,22.26 69.87,22.26 72.11,20.03 73.17,20.03 73.94,19.26 73.94,19.17 C2.1
  Bottom 0.203: v47.63,17.93 50.15,15.41 60.35,15.41 65.17,20.23 65.54,20.23 67.48,22.18 v67.48,22.26 67.76,22.26 68.47,22.97 68.47,23.31 71.49,26.33 71.74,26.33 v71.94,26.54
VBAT3  (via drill 0.6 pad 0.9)
  Top 1.016: VBAT3.TP 40.31,35.5 39.81,35 | v28.86,31.31 v23.39,31.31 | R1.1 39.87,34.45 39.81,34.51 39.81,35 | L5.2 39.81,35
  Bottom 1.016: v23.39,31.31 18.34,31.31 X2.8 X2.7 | v28.86,31.31 32.54,35 L5.2 37.5,35.46 C45.+
  other vias: 37.5,35
VBAT3_AD  (via drill 0.3 pad 0.61)
  Top 0.203: R1.2 40.81,33.22 40.81,32.46 38.62,30.27 38.62,29.39 39.49,28.52 39.88,28.52 40.93,27.46 40.93,27.02 45.9,22.04 46.15,22.04 46.68,21.51 46.68,19.72 48.09,18.32 R2.1 49.29,18.32 49.69,18.32 51.8,16.22 67.78,16.22 v67.95,16.38 | v73.94,22.39 73.47,22.86 73.47,23.47 U$14.91 | v71.6,18.95 71.81,19.16 C1.1
  Bottom 0.203: v73.94,22.39 v73.95,22.38 73.95,21.3 v71.6,18.95 70.51,18.95 v67.95,16.38
VBUS  (via drill 0.3 pad 0.61)
  Top 0.203: D2.A 48.54,42.56 49.47,43.48 v49.58,43.48 | v50.18,46.84 49.98,47.04 49.79,47.04 CN2.VBUS | U$2.VBUS 64.58,47.34 R27.1
  Bottom 0.203: 51.08,44.98 50.18,45.88 v50.18,46.84 | U$2.VBUS 62.15,44.92 51.14,44.92 51.08,44.98 | 51.08,44.98 v49.58,43.48
VIN  (via drill 0.3, 0.6)  (1 unrouted)
  Top 0.14: U$16.P$5B 10.5,50.29
  Top 0.25: U$18.P$5D 29.3,50.29 | 29.09,50.29 U$18.P$5C 28.9,50.29 | 11.09,50.29 U$16.P$5C 10.9,50.29 | U$19.P$5C 37.9,50.29 | U$17.P$5C 19.9,50.29 | U$17.P$5D 20.3,50.29 | U$19.P$5D 38.3,50.29
  Top 0.305: U$16.P$5A U$16.P$5C | U$16.P$5C U$16.P$5D | U$16.P$5D U$16.P$5E | U$16.P$5E U$16.P$5F U$16.P$5E | U$16.P$5E U$16.P$5D | U$16.P$5D U$16.P$5C | U$17.P$5A U$17.P$5B U$17.P$5C U$17.P$5D | 20.3,50.29 21.1,50.29 U$17.P$5F | v20.5,50.5 20.7,50.5 U$17.P$5E | U$18.P$5A U$18.P$5B | U$18.P$5F U$18.P$5E U$18.P$5D | U$18.P$5C 28.9,50.29 29.3,50.29 29.3,54 v38.5,54 38.5,51.5 arc-90 U$19.P$5A | U$19.P$5C U$19.P$5B 38.5,50.1 38.5,50.5 | U$19.P$5D U$19.P$5E U$19.P$5F | C30.1 29.5,52.05 29.5,52 | C33.1 38.5,52.17 38.5,52.25 | C36.1 20.5,52.24 20.5,51.25 | C39.1 11.5,52.23 11.5,52.25 | U$16.P$5E 11.7,54 v20.5,54
  Top 0.61: U$16.P$5B U$16.P$5C U$16.P$5D U$16.P$5E | U$17.P$5B U$17.P$5C U$17.P$5D U$17.P$5E | U$18.P$5B U$18.P$5C U$18.P$5D U$18.P$5E | U$19.P$5B U$19.P$5C U$19.P$5D U$19.P$5E
  Top 1.27: v11.5,54 11.5,52.25 11.5,50.5 | v20.5,54 20.5,51.25 v20.5,50.5 | v29.5,54 29.5,52 29.5,50.5 | 38.5,50.5 38.5,52.25 v38.5,54 v20.5,54 | v20.5,54 v9,54
  Bottom 1.93: D1.C 11,53.59 11,51
  Bottom 2.54: D1.C 38,53.59
  other vias: 11.5,51 20.5,52.75 29.5,52.75 38.5,53 29.5,51.25 38.5,51
  pour Route15: 8.25,57 46,57 46,49 8.25,49
VSW0
  Top 0.14: U$16.P$4A U$16.P$4B
  Top 0.25: 10.51,46.71 U$16.P$4B U$16.P$4C U$16.P$4D U$16.P$4E U$16.P$4F
  Top 1.016: 10.51,46.71 10.51,44.01 TP8.TP 10.5,42.94
  Top 2.184: L2.1 10.5,42.94
VSW1
  Top 0.14: 19.32,46.9 U$17.P$4B | U$17.P$4A 19.3,46.9
  Top 0.25: 20.89,46.71 U$17.P$4E 20.7,46.71 | 21.1,46.71 U$17.P$4F | U$17.P$4B 19.5,46.73 19.51,46.71 | 19.71,46.71 U$17.P$4C U$17.P$4D | 20.49,46.71 U$17.P$4D | U$17.P$4D | 19.3,46.9 19.32,46.9
  Top 1.016: 21.1,46.71 20.89,46.71 | 19.5,42.94 TP5.TP 19.51,44.01 19.51,46.71 19.71,46.71 | 20.7,46.71 20.49,46.71
  Top 2.184: L3.1 19.5,42.94
VSW2
  Top 0.14: U$18.P$4A 28.3,46.9 | 28.32,46.9 U$18.P$4B
  Top 0.25: 28.8,46.6 U$18.P$4B | U$18.P$4C 28.9,46.6 28.9,46.3 29.3,46.3 U$18.P$4D 29.49,46.71 | 29.89,46.71 U$18.P$4E 29.7,46.71 | 30.1,46.71 U$18.P$4F | 28.3,46.9 28.32,46.9
  Top 1.016: 28.9,46.6 28.8,46.6 | 30.1,46.71 29.89,46.71 | 29.7,46.71 29.49,46.71 | 28.9,46.3 28.9,44.4 TP10.TP 28.5,42.94
  Top 2.184: L4.1 28.5,42.94
VSW3
  Top 0.14: U$19.P$4A U$19.P$4B
  Top 0.25: U$19.P$4F U$19.P$4E U$19.P$4D U$19.P$4C U$19.P$4B 37.5,46.3
  Top 1.016: 37.5,46.3 TP15.TP
  Top 2.184: TP15.TP L5.1
XCIN
  Top 0.203: U$14.8 81.05,29.97 81.21,29.81 82.01,29.81 82.52,30.31 88.49,30.31 | Q1.1 89.05,29.2 88.49,29.76 88.49,30.31 | 88.49,30.31 88.73,30.55 C9.2
XCOUT
  Top 0.203: U$14.9 81.12,30.47 81.38,30.21 81.84,30.21 82.42,30.79 87.79,30.79 88.36,31.36 90.2,31.36 91,30.55 C11.2 91.76,29.75 92.1,29.41 Q1.4
XTAL
  Top 0.203: U$14.11 80.97,31.47 82.37,31.47 83.02,32.12 X1.P$1 86.01,32.12 86.44,31.69 C6.2